# EAGLE schematic Strain Gauge Amplifier2 (EAGLE 7.1.0)
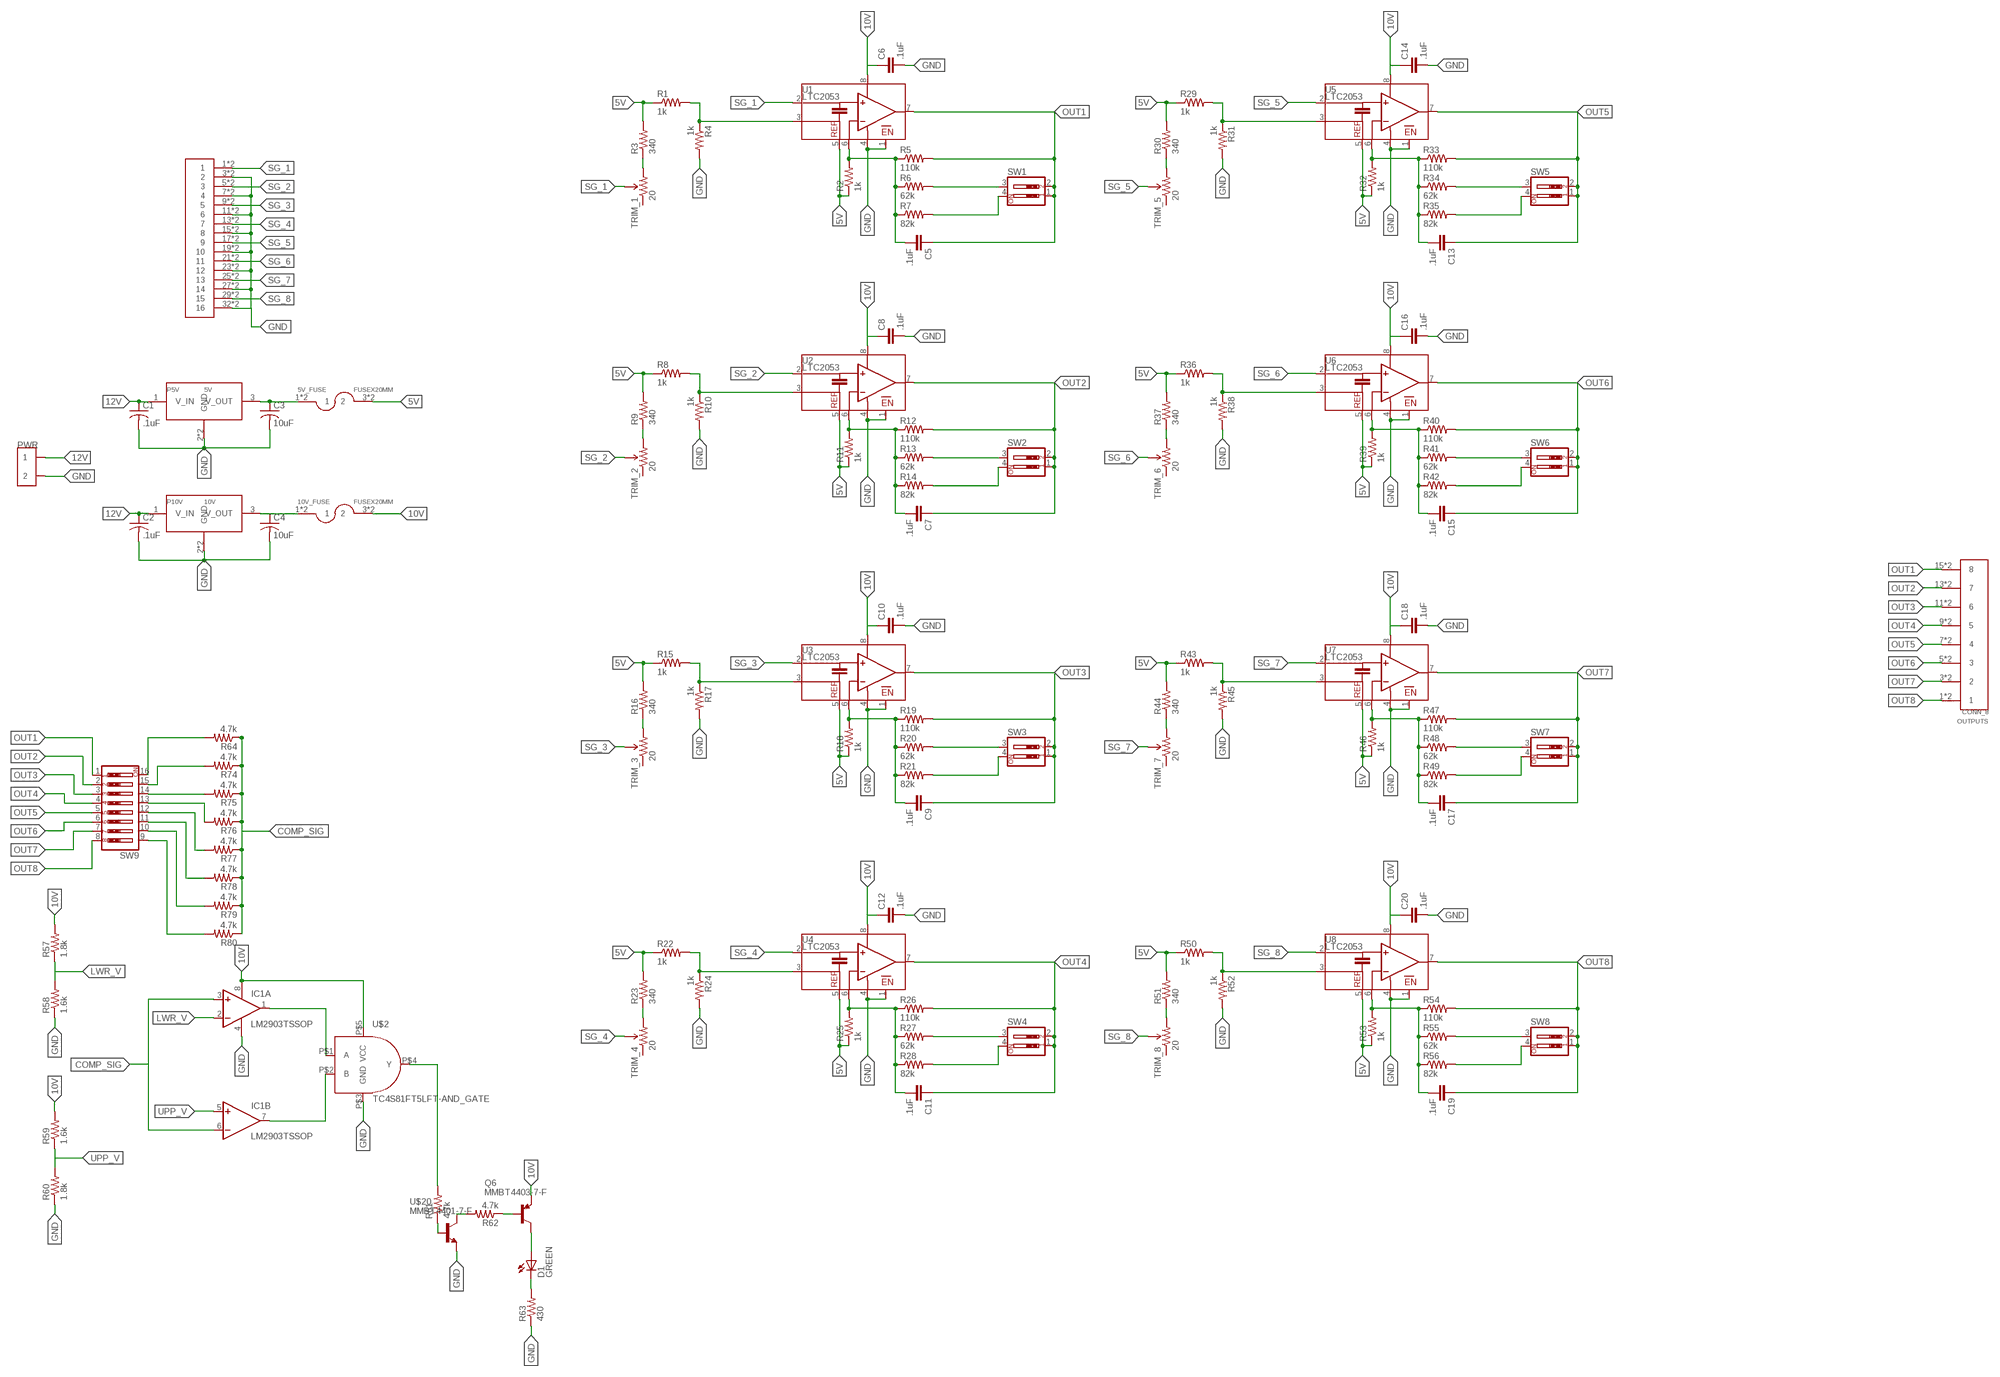
[diagram p0: schematic, sheet 1]

## Parts
5V_FUSE  FUSEX20MM  [FUSE_5MM]
10V_FUSE  FUSEX20MM  [FUSE_5MM]
C1  .1uF  C-USC0603  [C0603]
C2  .1uF  C-USC0603  [C0603]
C3  10uF  C-USC1206  [C1206]
C4  10uF  C-USC1206  [C1206]
C5  .1uF  CAP0603-CAP  [0603-CAP]
C6  .1uF  CAP0603-CAP  [0603-CAP]
C7  .1uF  CAP0603-CAP  [0603-CAP]
C8  .1uF  CAP0603-CAP  [0603-CAP]
C9  .1uF  CAP0603-CAP  [0603-CAP]
C10  .1uF  CAP0603-CAP  [0603-CAP]
C11  .1uF  CAP0603-CAP  [0603-CAP]
C12  .1uF  CAP0603-CAP  [0603-CAP]
C13  .1uF  CAP0603-CAP  [0603-CAP]
C14  .1uF  CAP0603-CAP  [0603-CAP]
C15  .1uF  CAP0603-CAP  [0603-CAP]
C16  .1uF  CAP0603-CAP  [0603-CAP]
C17  .1uF  CAP0603-CAP  [0603-CAP]
C18  .1uF  CAP0603-CAP  [0603-CAP]
C19  .1uF  CAP0603-CAP  [0603-CAP]
C20  .1uF  CAP0603-CAP  [0603-CAP]
D1  GREEN  LED-GREEN0603  [LED-0603]
IC1  LM2903TSSOP  [TSSOP8]
OUTPUTS  CONN_8  [CONNECTOR_8]
P5V  5V  LM2937  [SOT223]
P10V  10V  LM2937  [SOT223]
PWR  CONN_2  [CONNECTOR_2]
Q6  MMBT4403-7-F  [SOT-23-3]
R1  1k  RESISTOR0603  [0603-RES]
R2  1k  RESISTOR0603  [0603-RES]
R3  340  RESISTOR0603  [0603-RES]
R4  1k  RESISTOR0603  [0603-RES]
R5  110k  RESISTOR0603  [0603-RES]
R6  62k  RESISTOR0603  [0603-RES]
R7  82k  RESISTOR0603  [0603-RES]
R8  1k  RESISTOR0603  [0603-RES]
R9  340  RESISTOR0603  [0603-RES]
R10  1k  RESISTOR0603  [0603-RES]
R11  1k  RESISTOR0603  [0603-RES]
R12  110k  RESISTOR0603  [0603-RES]
R13  62k  RESISTOR0603  [0603-RES]
R14  82k  RESISTOR0603  [0603-RES]
R15  1k  RESISTOR0603  [0603-RES]
R16  340  RESISTOR0603  [0603-RES]
R17  1k  RESISTOR0603  [0603-RES]
R18  1k  RESISTOR0603  [0603-RES]
R19  110k  RESISTOR0603  [0603-RES]
R20  62k  RESISTOR0603  [0603-RES]
R21  82k  RESISTOR0603  [0603-RES]
R22  1k  RESISTOR0603  [0603-RES]
R23  340  RESISTOR0603  [0603-RES]
R24  1k  RESISTOR0603  [0603-RES]
R25  1k  RESISTOR0603  [0603-RES]
R26  110k  RESISTOR0603  [0603-RES]
R27  62k  RESISTOR0603  [0603-RES]
R28  82k  RESISTOR0603  [0603-RES]
R29  1k  RESISTOR0603  [0603-RES]
R30  340  RESISTOR0603  [0603-RES]
R31  1k  RESISTOR0603  [0603-RES]
R32  1k  RESISTOR0603  [0603-RES]
R33  110k  RESISTOR0603  [0603-RES]
R34  62k  RESISTOR0603  [0603-RES]
R35  82k  RESISTOR0603  [0603-RES]
R36  1k  RESISTOR0603  [0603-RES]
R37  340  RESISTOR0603  [0603-RES]
R38  1k  RESISTOR0603  [0603-RES]
R39  1k  RESISTOR0603  [0603-RES]
R40  110k  RESISTOR0603  [0603-RES]
R41  62k  RESISTOR0603  [0603-RES]
R42  82k  RESISTOR0603  [0603-RES]
R43  1k  RESISTOR0603  [0603-RES]
R44  340  RESISTOR0603  [0603-RES]
R45  1k  RESISTOR0603  [0603-RES]
R46  1k  RESISTOR0603  [0603-RES]
R47  110k  RESISTOR0603  [0603-RES]
R48  62k  RESISTOR0603  [0603-RES]
R49  82k  RESISTOR0603  [0603-RES]
R50  1k  RESISTOR0603  [0603-RES]
R51  340  RESISTOR0603  [0603-RES]
R52  1k  RESISTOR0603  [0603-RES]
R53  1k  RESISTOR0603  [0603-RES]
R54  110k  RESISTOR0603  [0603-RES]
R55  62k  RESISTOR0603  [0603-RES]
R56  82k  RESISTOR0603  [0603-RES]
R57  1.8k  RESISTOR0603  [0603-RES]
R58  1.6k  RESISTOR0603  [0603-RES]
R59  1.6k  RESISTOR0603  [0603-RES]
R60  1.8k  RESISTOR0603  [0603-RES]
R61  4.7k  RESISTOR0603  [0603-RES]
R62  4.7k  RESISTOR0603  [0603-RES]
R63  430  RESISTOR0603  [0603-RES]
R64  4.7k  RESISTOR0603  [0603-RES]
R74  4.7k  RESISTOR0603  [0603-RES]
R75  4.7k  RESISTOR0603  [0603-RES]
R76  4.7k  RESISTOR0603  [0603-RES]
R77  4.7k  RESISTOR0603  [0603-RES]
R78  4.7k  RESISTOR0603  [0603-RES]
R79  4.7k  RESISTOR0603  [0603-RES]
R80  4.7k  RESISTOR0603  [0603-RES]
SG_CONN  CONN_16  [CONNECTOR_16]
SW1  SW_DIP-2  [DIPSWITCH-02]
SW2  SW_DIP-2  [DIPSWITCH-02]
SW3  SW_DIP-2  [DIPSWITCH-02]
SW4  SW_DIP-2  [DIPSWITCH-02]
SW5  SW_DIP-2  [DIPSWITCH-02]
SW6  SW_DIP-2  [DIPSWITCH-02]
SW7  SW_DIP-2  [DIPSWITCH-02]
SW8  SW_DIP-2  [DIPSWITCH-02]
SW9  SW_DIP-8  [DIPSWITCH-08]
TRIM_1  20  3296Y  [3926_Y,Z]
TRIM_2  20  3296Y  [3926_Y,Z]
TRIM_3  20  3296Y  [3926_Y,Z]
TRIM_4  20  3296Y  [3926_Y,Z]
TRIM_5  20  3296Y  [3926_Y,Z]
TRIM_6  20  3296Y  [3926_Y,Z]
TRIM_7  20  3296Y  [3926_Y,Z]
TRIM_8  20  3296Y  [3926_Y,Z]
U1  LTC2053  [MSOP8]
U2  LTC2053  [MSOP8]
U3  LTC2053  [MSOP8]
U4  LTC2053  [MSOP8]
U5  LTC2053  [MSOP8]
U6  LTC2053  [MSOP8]
U7  LTC2053  [MSOP8]
U8  LTC2053  [MSOP8]
U$2  TC4S81FT5LFT-AND_GATE  [SSOP5-P-0.95]
U$20  MMBT4401-7-F  [SOT-23-3]

## Nets
5V: 5V_FUSE.3 5V_FUSE.4 R1.1 R2.1 R3.2 R8.1 R9.2 R11.1 R15.1 R16.2 R18.1 R22.1 R23.2 R25.1 R29.1 R30.2 R32.1 R36.1 R37.2 R39.1 R43.1 R44.2 R46.1 R50.1 R51.2 R53.1 U1.5(REF) U2.5(REF) U3.5(REF) U4.5(REF) U5.5(REF) U6.5(REF) U7.5(REF) U8.5(REF)
10V: 10V_FUSE.3 10V_FUSE.4 C6.1 C8.1 C10.1 C12.1 C14.1 C16.1 C18.1 C20.1 IC1.8(P:V+) Q6.P$3(E) R57.2 R59.2 U1.8(V+) U2.8(V+) U3.8(V+) U4.8(V+) U5.8(V+) U6.8(V+) U7.8(V+) U8.8(V+) U$2.P$5(VCC)
12V: C1.1 C2.1 P5V.1(V_IN) P10V.1(V_IN) PWR.1 PWR.2
COMP_SIG: IC1.3(A:+IN) IC1.6(B:-IN) R64.1 R74.1 R75.1 R76.1 R77.1 R78.1 R79.1 R80.1
GND: C1.2 C2.2 C3.2 C4.2 C6.2 C8.2 C10.2 C12.2 C14.2 C16.2 C18.2 C20.2 IC1.4(P:V-) P5V.2(GND) P5V.4(GND) P10V.2(GND) P10V.4(GND) PWR.3 PWR.4 R4.2 R10.2 R17.2 R24.2 R31.2 R38.2 R45.2 R52.2 R58.1 R60.1 R63.1 SG_CONN.3 SG_CONN.4 SG_CONN.7 SG_CONN.8 SG_CONN.11 SG_CONN.12 SG_CONN.15 SG_CONN.16 SG_CONN.19 SG_CONN.20 SG_CONN.23 SG_CONN.24 SG_CONN.27 SG_CONN.28 SG_CONN.32 SG_CONN.P31 U1.1(EN) U1.4(V-) U2.1(EN) U2.4(V-) U3.1(EN) U3.4(V-) U4.1(EN) U4.4(V-) U5.1(EN) U5.4(V-) U6.1(EN) U6.4(V-) U7.1(EN) U7.4(V-) U8.1(EN) U8.4(V-) U$2.P$3(GND) U$20.P$3(E)
LWR_V: IC1.2(A:-IN) R57.1 R58.2
N$1: C5.2 R2.2 R5.1 R6.1 R7.1 U1.6(RG)
N$2: 5V_FUSE.1 5V_FUSE.2 C3.1 P5V.3(V_OUT)
N$3: 10V_FUSE.1 10V_FUSE.2 C4.1 P10V.3(V_OUT)
N$4: R1.2 R4.1 U1.3(+IN)
N$5: IC1.1(A:OUT) U$2.P$1(A)
N$6: R3.1 TRIM_1.3(CW)
N$7: R6.2 SW1.3
N$8: R7.2 SW1.4
N$9: R8.2 R10.1 U2.3(+IN)
N$10: C7.2 R11.2 R12.1 R13.1 R14.1 U2.6(RG)
N$11: IC1.7(B:OUT) U$2.P$2(B)
N$12: R9.1 TRIM_2.3(CW)
N$13: R13.2 SW2.3
N$14: R14.2 SW2.4
N$15: R15.2 R17.1 U3.3(+IN)
N$16: C9.2 R18.2 R19.1 R20.1 R21.1 U3.6(RG)
N$17: R61.1 U$20.P$2(B)
N$18: R16.1 TRIM_3.3(CW)
N$19: R20.2 SW3.3
N$20: R21.2 SW3.4
N$21: R22.2 R24.1 U4.3(+IN)
N$22: C11.2 R25.2 R26.1 R27.1 R28.1 U4.6(RG)
N$23: R62.2 U$20.P$1(C)
N$24: R23.1 TRIM_4.3(CW)
N$25: R27.2 SW4.3
N$26: R28.2 SW4.4
N$27: R29.2 R31.1 U5.3(+IN)
N$28: C13.2 R32.2 R33.1 R34.1 R35.1 U5.6(RG)
N$29: Q6.P$2(B) R62.1
N$30: R30.1 TRIM_5.3(CW)
N$31: R34.2 SW5.3
N$32: R35.2 SW5.4
N$33: R36.2 R38.1 U6.3(+IN)
N$34: C15.2 R39.2 R40.1 R41.1 R42.1 U6.6(RG)
N$35: R61.2 U$2.P$4(Y)
N$36: R37.1 TRIM_6.3(CW)
N$37: R41.2 SW6.3
N$38: R42.2 SW6.4
N$39: R43.2 R45.1 U7.3(+IN)
N$40: C17.2 R46.2 R47.1 R48.1 R49.1 U7.6(RG)
N$41: D1.A Q6.P$1(C)
N$42: R44.1 TRIM_7.3(CW)
N$43: R48.2 SW7.3
N$44: R49.2 SW7.4
N$45: R50.2 R52.1 U8.3(+IN)
N$46: C19.2 R53.2 R54.1 R55.1 R56.1 U8.6(RG)
N$47: D1.C R63.2
N$48: R51.1 TRIM_8.3(CW)
N$49: R55.2 SW8.3
N$50: R56.2 SW8.4
N$65: R64.2 SW9.16
N$66: R74.2 SW9.15
N$67: R75.2 SW9.14
N$68: R76.2 SW9.13
N$69: R77.2 SW9.12
N$70: R78.2 SW9.11
N$73: R79.2 SW9.10
N$74: R80.2 SW9.9
OUT1: C5.1 OUTPUTS.15 OUTPUTS.16 R5.2 SW1.1 SW1.2 SW9.1 U1.7(OUT)
OUT2: C7.1 OUTPUTS.13 OUTPUTS.14 R12.2 SW2.1 SW2.2 SW9.2 U2.7(OUT)
OUT3: C9.1 OUTPUTS.11 OUTPUTS.12 R19.2 SW3.1 SW3.2 SW9.3 U3.7(OUT)
OUT4: C11.1 OUTPUTS.9 OUTPUTS.10 R26.2 SW4.1 SW4.2 SW9.4 U4.7(OUT)
OUT5: C13.1 OUTPUTS.7 OUTPUTS.8 R33.2 SW5.1 SW5.2 SW9.5 U5.7(OUT)
OUT6: C15.1 OUTPUTS.5 OUTPUTS.6 R40.2 SW6.1 SW6.2 SW9.6 U6.7(OUT)
OUT7: C17.1 OUTPUTS.3 OUTPUTS.4 R47.2 SW7.1 SW7.2 SW9.7 U7.7(OUT)
OUT8: C19.1 OUTPUTS.1 OUTPUTS.2 R54.2 SW8.1 SW8.2 SW9.8 U8.7(OUT)
SG_1: SG_CONN.1 SG_CONN.2 TRIM_1.2(WIPER) U1.2(-IN)
SG_2: SG_CONN.5 SG_CONN.6 TRIM_2.2(WIPER) U2.2(-IN)
SG_3: SG_CONN.9 SG_CONN.10 TRIM_3.2(WIPER) U3.2(-IN)
SG_4: SG_CONN.13 SG_CONN.14 TRIM_4.2(WIPER) U4.2(-IN)
SG_5: SG_CONN.17 SG_CONN.18 TRIM_5.2(WIPER) U5.2(-IN)
SG_6: SG_CONN.21 SG_CONN.22 TRIM_6.2(WIPER) U6.2(-IN)
SG_7: SG_CONN.25 SG_CONN.26 TRIM_7.2(WIPER) U7.2(-IN)
SG_8: SG_CONN.29 SG_CONN.30 TRIM_8.2(WIPER) U8.2(-IN)
UPP_V: IC1.5(B:+IN) R59.1 R60.2
Unconnected: TRIM_1.1(CCW) TRIM_2.1(CCW) TRIM_3.1(CCW) TRIM_4.1(CCW) TRIM_5.1(CCW) TRIM_6.1(CCW) TRIM_7.1(CCW) TRIM_8.1(CCW)

## Library data of the parts
5V_FUSE 10V_FUSE = SparkFun-Passives:FUSE
C1-C4 = resistor:C-US: CAPACITOR, American symbol
C5-C20 = SparkFun-Passives:CAP: Capacitor Standard 0603 ceramic capacitor, and 0.1" leaded capacitor.
D1 = SparkFun-LED:LED-GREEN: Various green LEDs 0603- DIO-00821 LARGE- DIO-00862 LILYPAD- DIO-09910; PROD_ID: DIO-00821
IC1 = linear:LM2903: COMPARATOR
OUTPUTS = formula electric:CONN_8
P5V P10V = texas:LM2937
PWR = formula electric:CONN_2
Q6 = formula electric:MMBT4403-7-F
R1-R64 R74-R80 = SparkFun-Resistors:RESISTOR: Resistor Basic schematic elements and footprints for 0603, 1206, and PTH resistors.
SG_CONN = formula electric:CONN_16
SW1-SW8 = SparkFun-Electromechanical:SW_DIP-2: DIP SWITCH
SW9 = SparkFun-Electromechanical:SW_DIP-8: DIP Switch 8 Position Spark Fun Electronics SKU : COM-08034
TRIM_1-TRIM_8 = bourns:3296Y: Trimpot
U1-U8 = linear-technology:LTC2053: DK: LTC2053CMS8#PBF-ND
U$2 = formula electric:TC4S81FT5LFT-AND_GATE: TC4S81FT5LFTCT-ND
U$20 = formula electric:MMBT4401-7-F